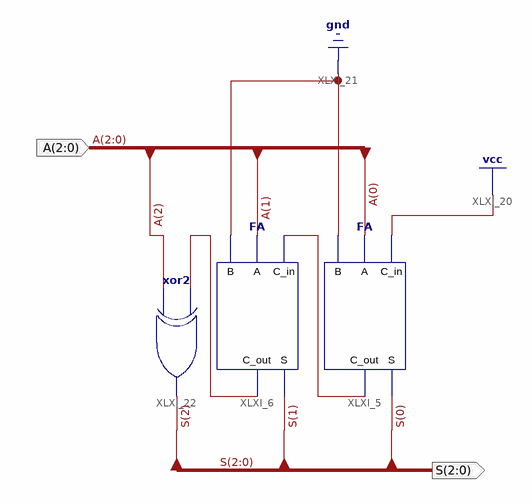
[diagram p0: schematic sheet 1]
// Xilinx ISE schematic Adder_3bit.sch (spartan3e) as structural Verilog: 3 symbols, 2 ports
module Adder_3bit (
  input  [2:0] A,
  output [2:0] S
);

  wire XLXN_1, XLXN_70;

  FA XLXI_5 (.A(A[0]), .B(1'b0), .C_in(1'b1), .C_out(XLXN_1), .S(S[0]));
  FA XLXI_6 (.A(A[1]), .B(1'b0), .C_in(XLXN_1), .C_out(XLXN_70), .S(S[1]));
  xor XLXI_22 (S[2], A[2], XLXN_70);
endmodule
